# EasyEDA Pro project ADC.eprj

# Schematic Schematic1
Create Date: 2023-12-13; Page Name: P1; Project Name: ADC; Schematic Name: Schematic1; Update Date: 2023-12-21; Company: 嘉立创EDA; Page Size: A4; Version: V1.0
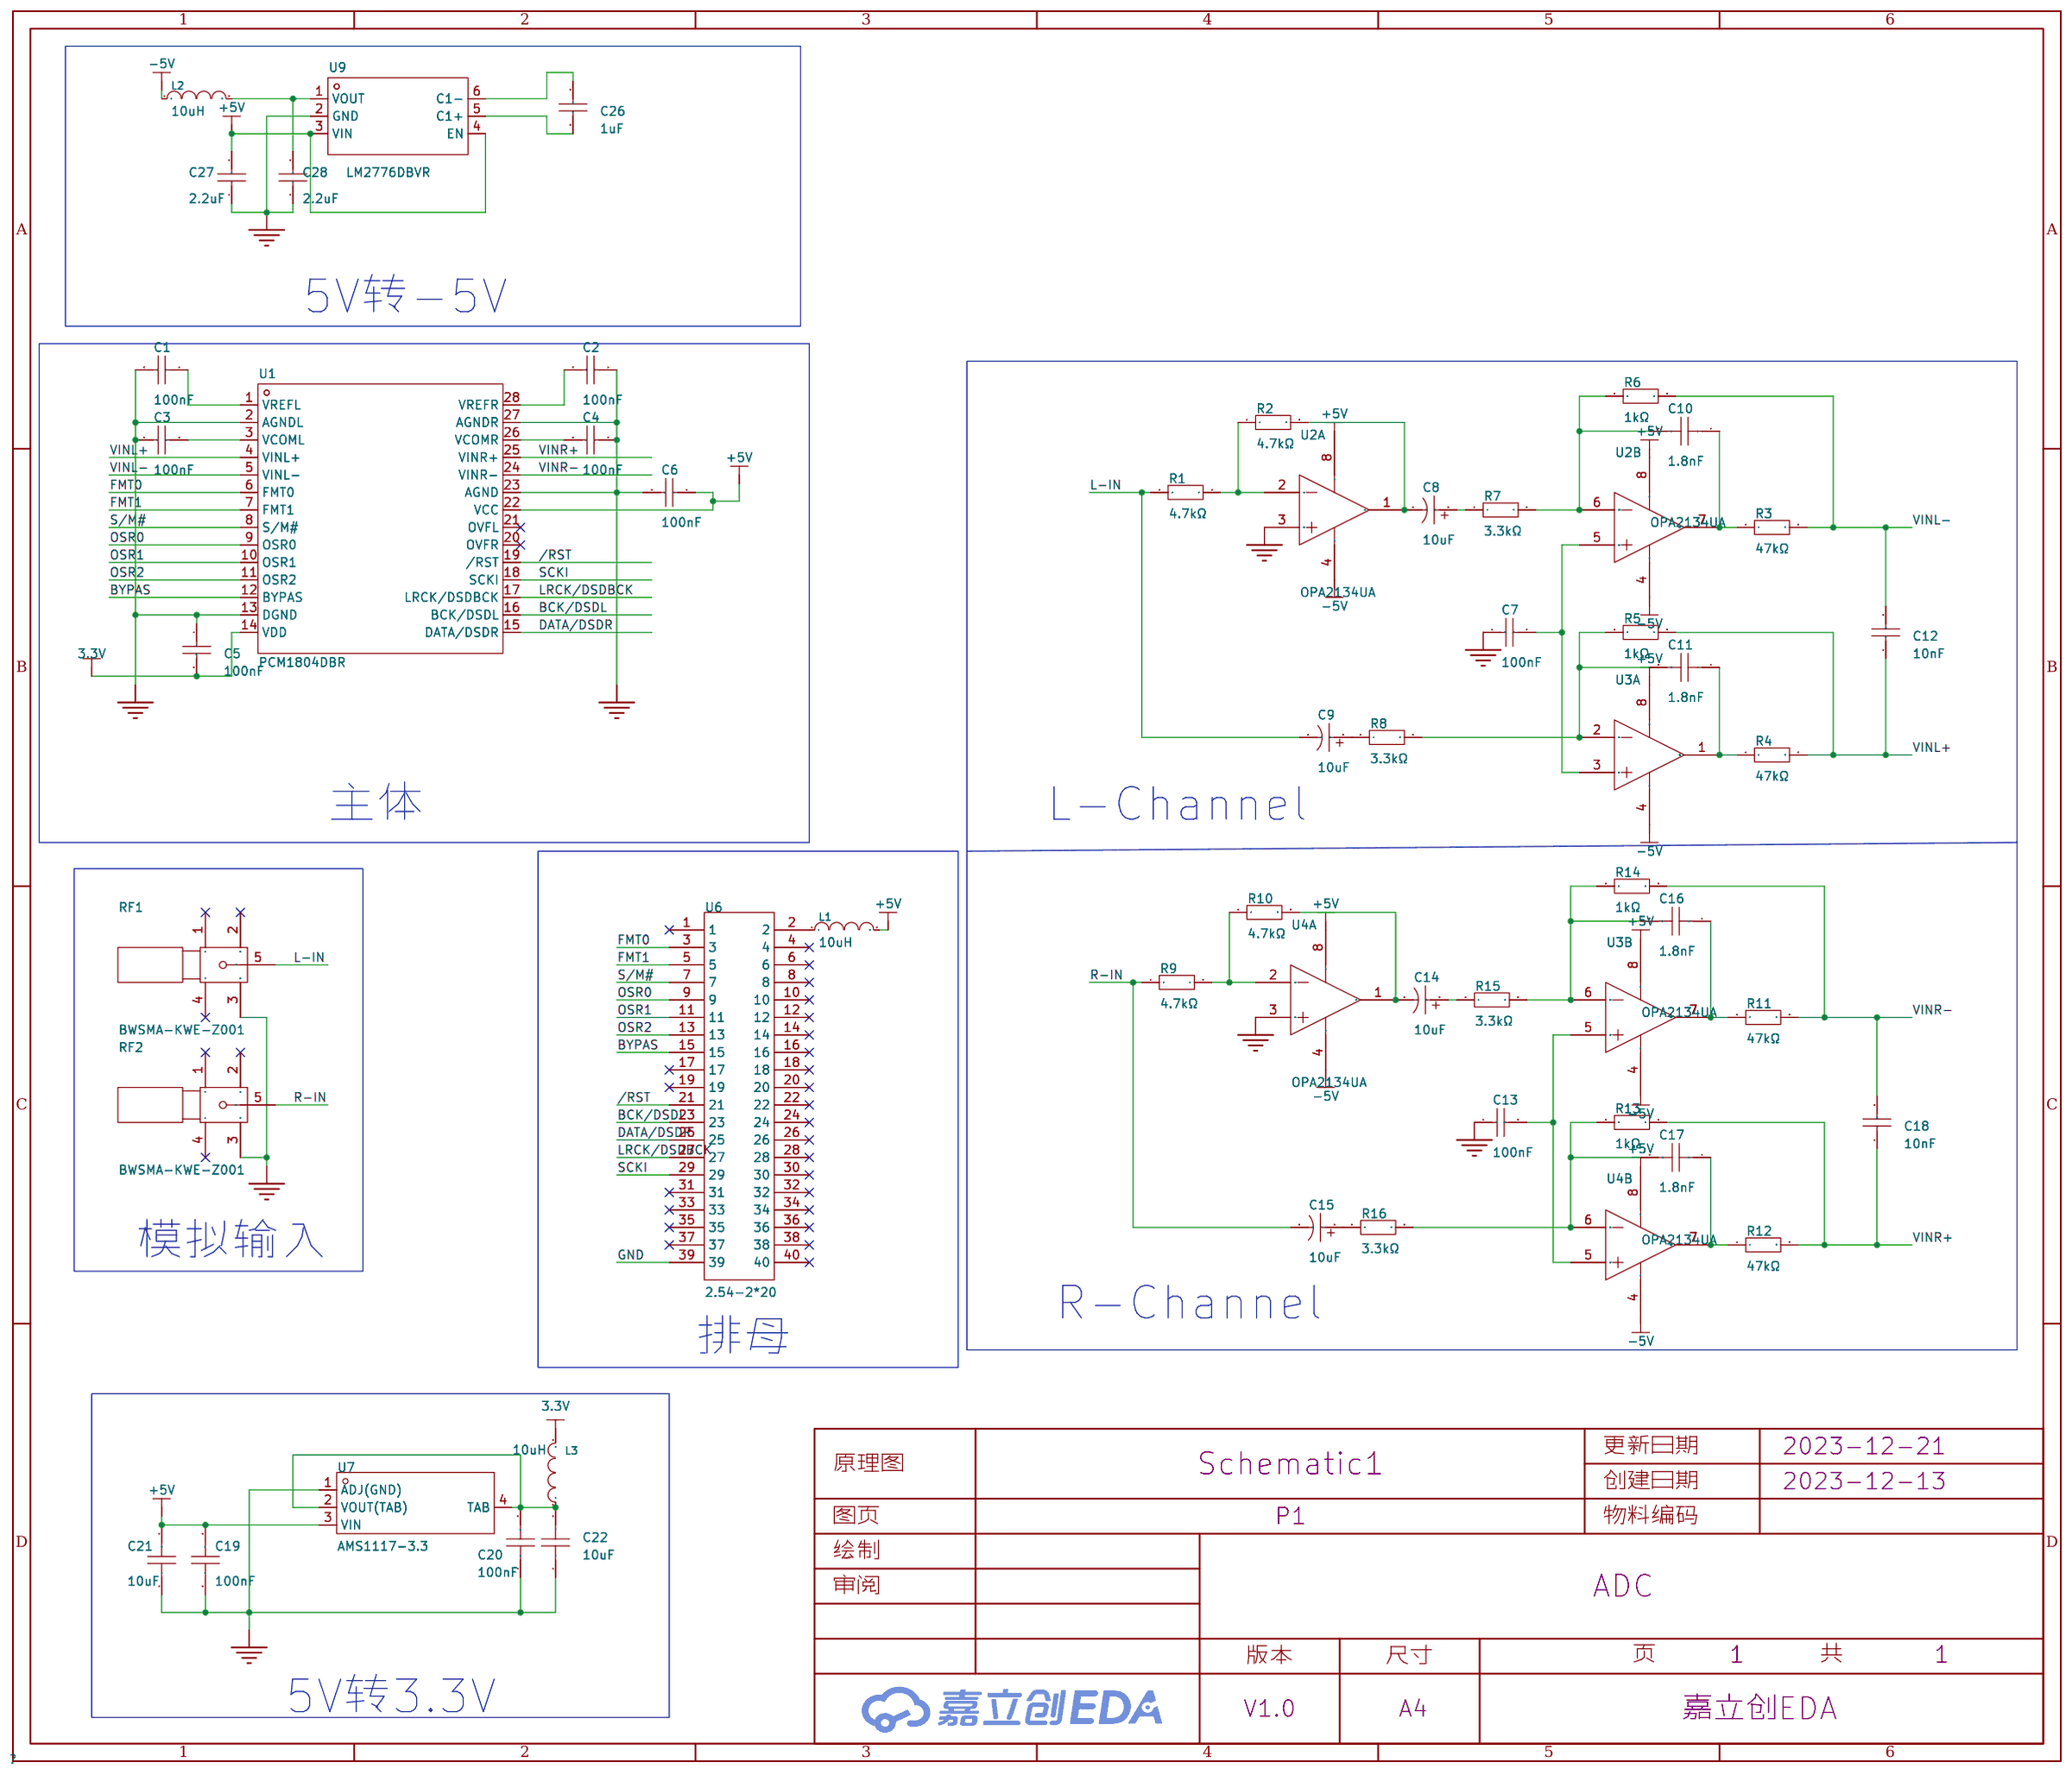
[diagram p0: schematic sheet]

## Parts
C1  100nF  [C0603]
C2  100nF  [C0603]
C3  100nF  [C0603]
C4  100nF  [C0603]
C5  100nF  [C0603]
C6  100nF  [C0603]
C7  100nF  [C0603]
C8  10uF  [CAP-SMD_BD6.3-L6.6-W6.6-FD]
C9  10uF  [CAP-SMD_BD6.3-L6.6-W6.6-FD]
C10  1.8nF  [C0603]
C11  1.8nF  [C0603]
C12  10nF  [C0603]
C13  100nF  [C0603]
C14  10uF  [CAP-SMD_BD6.3-L6.6-W6.6-FD]
C15  10uF  [CAP-SMD_BD6.3-L6.6-W6.6-FD]
C16  1.8nF  [C0603]
C17  1.8nF  [C0603]
C18  10nF  [C0603]
C19  100nF  [C0603]
C20  100nF  [C0603]
C21  10uF  [C0603]
C22  10uF  [C0603]
C26  1uF  [C0603]
C27  2.2uF  [C0603]
C28  2.2uF  [C0603]
L1  10uH  [L0603]
L2  10uH  [L0603]
L3  10uH  [L0603]
R1  4.7kΩ  [R0603]
R2  4.7kΩ  [R0603]
R3  47kΩ  [R0603]
R4  47kΩ  [R0603]
R5  1kΩ  [R0603]
R6  1kΩ  [R0603]
R7  3.3kΩ  [R0603]
R8  3.3kΩ  [R0603]
R9  4.7kΩ  [R0603]
R10  4.7kΩ  [R0603]
R11  47kΩ  [R0603]
R12  47kΩ  [R0603]
R13  1kΩ  [R0603]
R14  1kΩ  [R0603]
R15  3.3kΩ  [R0603]
R16  3.3kΩ  [R0603]
RF1  BWSMA-KWE-Z001  [SMA-TH_BWSMA-KWE-Z001]
RF2  BWSMA-KWE-Z001  [SMA-TH_BWSMA-KWE-Z001]
U1  PCM1804DBR  [SSOP-28_L10.2-W5.3-P0.65-LS7.8-BL]
U2  OPA2134UA  [SOIC-8_L4.9-W3.9-P1.27-LS6.0-BL]  (sections 1,2)
U3  OPA2134UA  [SOIC-8_L4.9-W3.9-P1.27-LS6.0-BL]  (sections 1,2)
U4  OPA2134UA  [SOIC-8_L4.9-W3.9-P1.27-LS6.0-BL]  (sections 1,2)
U6  2.54-2*20  [HDR-TH_40P-P2.54-V-F-R2-C20-S2.54]
U7  AMS1117-3.3  [SOT-223-4_L6.5-W3.5-P2.30-LS7.0-BR]
U9  LM2776DBVR  [SOT-23-6_L2.9-W1.6-P0.95-LS2.8-BR]

## Library data of the parts
C1-C7 C13 = CC0603KRX7R9BB104: 容值:100nF;精度:±10%;额定电压:50V;材质(温度系数):X7R;; LCSC Part Name: 100nF ±10% 50V; Supplier Part: C14663; Manufacturer: YAGEO(国巨); Supplier Footprint: 0603; JLCPCB Part Class: Basic Part; Datasheet: https://atta.szlcsc.com/upload/public/pdf/source/20180910/C282072_33301C7F631E79921B82A8DAC6BCC5B3.pdf; Supplier: LCSC; Tolerance: ±10%; Voltage Rated: 50V; Temperature Coefficient: X7R
C8 C9 C14 C15 = RVT2A100M0607_C72482: 容值:10uF;精度:±20%;额定电压:100V;纹波电流:38mA@120Hz;等效串联电阻:-;; LCSC Part Name: 10uF ±20% 100V; Supplier Part: C72482; Manufacturer: ROQANG(容强); Manufacturer Part: RVT2A100M0607; Supplier Footprint: SMD,D6.3xL7.7mm; JLCPCB Part Class: 扩展库; Datasheet: https://atta.szlcsc.com/upload/public/pdf/source/20170325/1490427950282.pdf; Supplier: LCSC; Tolerance: ±20%; Rated Voltage: 100V; Ripple Current: 38mA@120Hz; φD: 6.3mm; L: 7.7mm; Lifetime @ Temp: 2000hrs@105℃; Operating Temperature: -40℃~+105℃
C10 C11 C16 C17 = 0603B182K500NT: 容值:1.8nF;精度:±10%;额定电压:50V;材质(温度系数):X7R;; LCSC Part Name: 1.8nF ±10% 50V; Supplier Part: C1599; Manufacturer: FH(风华); Supplier Footprint: 0603; JLCPCB Part Class: Extended Part; Datasheet: https://atta.szlcsc.com/upload/public/pdf/source/20200305/C486355_26A10D38EF8C2A5C37091D0039909270.pdf; Supplier: LCSC; Tolerance: ±10%; Voltage Rated: 50V; Temperature Coefficient: X7R
C12 C18 = CC0603KRX7R9BB103: 容值:10nF;精度:±10%;额定电压:50V;材质(温度系数):X7R;; LCSC Part Name: 10nF ±10% 50V; Supplier Part: C100042; Manufacturer: YAGEO(国巨); Supplier Footprint: 0603; JLCPCB Part Class: Extended Part; Datasheet: https://atta.szlcsc.com/upload/public/pdf/source/20181008/C309510_22F155564471FAF6A489F7D68F34234E.pdf; Supplier: LCSC; Tolerance: ±10%; Voltage Rated: 50V; Temperature Coefficient: X7R
C19 C20 = CC0603KRX7R9BB104: 容值:100nF;精度:±10%;额定电压:50V;材质(温度系数):X7R;; LCSC Part Name: 100nF ±10% 50V; Supplier Part: C14663; Manufacturer: YAGEO(国巨); Supplier Footprint: 0603; JLCPCB Part Class: 基础库; Datasheet: https://atta.szlcsc.com/upload/public/pdf/source/20180910/C282072_33301C7F631E79921B82A8DAC6BCC5B3.pdf; Supplier: LCSC; Tolerance: ±10%; Voltage Rated: 50V; Temperature Coefficient: X7R
C21 C22 = CL10A106KP8NNNC: 容值:10uF;精度:±10%;额定电压:10V;材质(温度系数):X5R;; LCSC Part Name: 10uF ±10% 10V; Supplier Part: C19702; Manufacturer: SAMSUNG(三星); Supplier Footprint: 0603; JLCPCB Part Class: 基础库; Datasheet: https://atta.szlcsc.com/upload/public/pdf/source/20160218/1457707763339.pdf; Supplier: LCSC; Tolerance: ±10%; Voltage Rated: 10V; Temperature Coefficient: X5R
C26 = CL10A105KB8NNNC: 容值:1uF;精度:±10%;额定电压:50V;材质(温度系数):X5R;; LCSC Part Name: 1uF ±10% 50V; Supplier Part: C15849; Manufacturer: SAMSUNG(三星); Supplier Footprint: 0603; JLCPCB Part Class: 基础库; Datasheet: https://atta.szlcsc.com/upload/public/pdf/source/20160218/1457707763339.pdf; Supplier: LCSC; Tolerance: ±10%; Voltage Rated: 50V; Temperature Coefficient: X5R
C27 C28 = CL10A225KO8NNNC: 容值:2.2uF;精度:±10%;额定电压:16V;材质(温度系数):X5R;; LCSC Part Name: 2.2uF ±10% 16V; Supplier Part: C23630; Manufacturer: SAMSUNG(三星); Supplier Footprint: 0603; JLCPCB Part Class: 基础库; Datasheet: https://atta.szlcsc.com/upload/public/pdf/source/20160218/1457707763339.pdf; Supplier: LCSC; Tolerance: ±10%; Voltage Rated: 16V; Temperature Coefficient: X5R
L1-L3 = SDFL1608S100KTF: 电感值:10uH;精度:±10%;额定电流:3mA;饱和电流(Isat):-;直流电阻(DCR):1.85Ω;; LCSC Part Name: 10uH ±10% 3mA 1.85Ω; Supplier Part: C1035; Manufacturer: Sunlord(顺络); Supplier Footprint: 0603; JLCPCB Part Class: 基础库; Supplier: LCSC; Tolerance: ±10%; Rated Current: 3mA; DC Resistance (DCR): 1.85Ω; Q @ Freq: 30@2MHz; Frequency - Self Resonant: 2MHz
R1 R2 R9 R10 = 0603WAF4701T5E: 阻值:4.7kΩ;精度:±1%;功率:100mW;温度系数:±100ppm/℃;电阻类型:厚膜电阻;; LCSC Part Name: 4.7kΩ ±1% 100mW 厚膜电阻; Supplier Part: C23162; Manufacturer: UNI-ROYAL(厚声); Supplier Footprint: 0603; JLCPCB Part Class: 基础库; Datasheet: https://atta.szlcsc.com/upload/public/pdf/source/20200306/C422600_1E6D84923E4A46A82E41ADD87F860B5C.pdf; Supplier: LCSC; Tolerance: ±1%; Power(Watts): 100mW; Overload Voltage (Max): 75V; Temperature Coefficient: ±100ppm/℃; Type: 厚膜电阻; Operating Temperature Range: -55℃~+155℃
R3 R4 R11 R12 = 0603WAF4702T5E: 阻值:47kΩ;精度:±1%;功率:100mW;温度系数:±100ppm/℃;电阻类型:厚膜电阻;; LCSC Part Name: 47kΩ ±1% 100mW 厚膜电阻; Supplier Part: C25819; Manufacturer: UNI-ROYAL(厚声); Supplier Footprint: 0603; JLCPCB Part Class: 基础库; Datasheet: https://atta.szlcsc.com/upload/public/pdf/source/20200306/C422600_1E6D84923E4A46A82E41ADD87F860B5C.pdf; Supplier: LCSC; Tolerance: ±1%; Power(Watts): 100mW; Overload Voltage (Max): 75V; Temperature Coefficient: ±100ppm/℃; Type: 厚膜电阻; Operating Temperature Range: -55℃~+155℃
R5 R6 R13 R14 = 0603WAF1001T5E: 阻值:1kΩ;精度:±1%;功率:100mW;温度系数:±100ppm/℃;电阻类型:厚膜电阻;; LCSC Part Name: 1kΩ ±1% 100mW 厚膜电阻; Supplier Part: C21190; Manufacturer: UNI-ROYAL(厚声); Supplier Footprint: 0603; JLCPCB Part Class: Basic Part; Datasheet: https://atta.szlcsc.com/upload/public/pdf/source/20200306/C422600_1E6D84923E4A46A82E41ADD87F860B5C.pdf; Supplier: LCSC; Tolerance: ±1%; Power(Watts): 100mW; Overload Voltage (Max): 75V; Temperature Coefficient: ±100ppm/℃; Type: 厚膜电阻; Operating Temperature Range: -55℃~+155℃
R7 R8 R15 R16 = 0603WAF3301T5E: 阻值:3.3kΩ;精度:±1%;功率:100mW;温度系数:±100ppm/℃;电阻类型:厚膜电阻;; LCSC Part Name: 3.3kΩ ±1% 100mW 厚膜电阻; Supplier Part: C22978; Manufacturer: UNI-ROYAL(厚声); Supplier Footprint: 0603; JLCPCB Part Class: 基础库; Datasheet: https://atta.szlcsc.com/upload/public/pdf/source/20200306/C422600_1E6D84923E4A46A82E41ADD87F860B5C.pdf; Supplier: LCSC; Tolerance: ±1%; Power(Watts): 100mW; Overload Voltage (Max): 75V; Temperature Coefficient: ±100ppm/℃; Type: 厚膜电阻; Operating Temperature Range: -55℃~+155℃
RF1 RF2 = BWSMA-KWE-Z001: 连接器类型:板端;接口类型:内孔;频率-最大值:-;接口直径:5.3mm;射频系列:SMA;端口数量:1;阻抗:50Ω;样式:弯头;接口长度/高度:-;触头材质:-;触头镀层:-;工作温度范围:-;焊接温度(最大值):-;; LCSC Part Name: 内孔 SMA 弯头 SMA 天线座 SMA弯头正脚板端座子; Supplier Part: C496551; Manufacturer: BAT WIRELESS(蝙蝠无线); Supplier Footprint: 插件; JLCPCB Part Class: 扩展库; Datasheet: https://atta.szlcsc.com/upload/public/pdf/source/20231017/997A8C2ADA7F8034A89BE1264F38CE52.pdf; Supplier: LCSC; Connector Type: 板端; Interface Type: 内孔; Interface Diameter: 5.3mm; RF Series: SMA; Number of Ports: 1; Impedance: 50Ω; Style: 弯头
U1 = PCM1804DBR: 供电电压:3V~3.6V；4.75V~5.25V;分辨率(位):24;接口类型:I2S;; Supplier Part: C62360; Manufacturer: TI(德州仪器); Supplier Footprint: SSOP-28-208mil; JLCPCB Part Class: 扩展库; Datasheet: https://www.ti.com/cn/lit/gpn/pcm1804; Supplier: LCSC; Supply Voltage: 3V~3.6V；4.75V~5.25V; Number of Channels: 2; Resolution: 24; Interface Type: I2S; Operating Temperature: -10℃~+70℃
U2-U4 = OPA2134UA: 功放类型:-;扬声器通道数:2通道;输出功率:-;; Supplier Part: C2860321; Manufacturer: TI(德州仪器); Supplier Footprint: SOIC-8; JLCPCB Part Class: Extended Part; Datasheet: https://atta.szlcsc.com/upload/public/pdf/source/20230221/04F5AACAA47A202A62C17BFD20F1D2D5.pdf; Supplier: LCSC; Speaker Channels: 2通道; Operating Temperature: -40℃~+85℃
U6 = 2.54-2*20: 排数:双排;总孔位数:40P;间距:2.54mm;插孔结构:2x20P;行距:2.54mm;安装类型:直插;圆孔/方孔:方孔;额定电流:2.5A;额定电压:-;插孔方向:顶部;塑高:8.5mm;工作温度范围:-40℃~+105℃;; LCSC Part Name: 间距:2.54mm 2x20P 直插 镀金环保阻燃UL认证; Supplier Part: C2977589; Manufacturer: ZHOURI(洲日); Supplier Footprint: 插件,P=2.54mm; JLCPCB Part Class: 扩展库; Datasheet: https://atta.szlcsc.com/upload/public/pdf/source/20220328/834E302BE3C038BBC5C70F5E02589B1E.pdf; Supplier: LCSC; Number of Rows: 双排; Number of Holes: 40P; Pitch: 2.54mm; Holes Structure: 2x20P; Row Spacing: 2.54mm; Mounting Type: 直插; Circular Hole / Square Hole: 方孔; Current Rating (Max): 2.5A; Holes Direction: 顶部; Insulation Height: 8.5mm; Operating Temperature Range: -40℃~+105℃
U7 = AMS1117-3.3_C347222: 输出类型:固定;最大输入电压:18V;输出电压:3.3V;输出电流:1A;电源纹波抑制比(PSRR):60dB@(120Hz);输出极性:正;; LCSC Part Name: 输入18V 输出3.3V 1A; Supplier Part: C347222; Manufacturer: UMW(友台半导体); Supplier Footprint: SOT-223; JLCPCB Part Class: 扩展库; Datasheet: https://atta.szlcsc.com/upload/public/pdf/source/20231109/155D79A26D9DB04352555A58D5969DC8.pdf; Supplier: LCSC; Output Type: 固定; Maximum Input Voltage: 18V; Output Voltage: 3.3V; Output Current: 1A; Power Supply Rejection Ratio (PSRR): 60dB@(120Hz); Dropout Voltage: 1.3V@(1A); Output Polarity: 正; Number of Outputs: 1
U9 = LM2776DBVR: 功能类型:电荷泵;输出类型:固定;输入电压:2.7V~5.5V;输出电压:-5.5V~-2.7V;输出电流(最大值):200mA;; Supplier Part: C69527; Manufacturer: TI(德州仪器); Supplier Footprint: SOT-23-6; JLCPCB Part Class: 扩展库; Datasheet: https://www.ti.com/cn/lit/gpn/lm2776; Supplier: LCSC; Function: 电荷泵; Synchronous Rectification: 否; Output Type: 固定; Number of Outputs: 1; Input Voltage: 2.7V~5.5V; Output Voltage: -5.5V~-2.7V; Output Current (Max): 200mA; Switching Frequency: 2MHz; Operating Temperature: -40℃~+85℃@(TA)

## Nets
3.3V: C5.2 L3.2 U1.14(VDD)
+5V: C6.1 C19.2 C21.2 C27.2 L1.2 U1.22(VCC) U2.8(V+) U3.8(V+) U4.8(V+) U7.3(VIN) U9.3(VIN) U9.4(EN)
-5V: L2.1 U2.4(V-) U3.4(V-) U4.4(V-)
GND: C1.2 C2.1 C3.2 C4.1 C5.1 C6.2 C7.1 C13.1 C19.1 C20.1 C21.1 C22.1 C27.1 C28.1 RF1.3 RF2.3 U1.2(AGNDL) U1.13(DGND) U1.23(AGND) U1.27(AGNDR) U2.3(+IN A) U4.3(+IN A) U6.39 U7.1(ADJ(GND)) U9.2(GND)
VINL+: C12.1 R4.2 R5.2 U1.4(VINL+)
VINL-: C12.2 R3.2 R6.2 U1.5(VINL-)
VINR+: C18.1 R12.2 R13.2 U1.25(VINR+)
VINR-: C18.2 R11.2 R14.2 U1.24(VINR-)
/RST: U1.19(/RST) U6.21
BCK/DSDL: U1.16(BCK/DSDL) U6.23
BYPAS: U1.12(BYPAS) U6.15
DATA/DSDR: U1.15(DATA/DSDR) U6.25
FMT0: U1.6(FMT0) U6.3
FMT1: U1.7(FMT1) U6.5
L-IN: C9.2 R1.1 RF1.5
LRCK/DSDBCK: U1.17(LRCK/DSDBCK) U6.27
OSR0: U1.9(OSR0) U6.9
OSR1: U1.10(OSR1) U6.11
OSR2: U1.11(OSR2) U6.13
R-IN: C15.2 R9.1 RF2.5
S/M#: U1.8(S/M#) U6.7
SCKI: U1.18(SCKI) U6.29
$1N1209: C1.1 U1.1(VREFL)
$1N1212: C3.1 U1.3(VCOML)
$1N1256: C2.2 U1.28(VREFR)
$1N1259: C4.2 U1.26(VCOMR)
$1N1970: R1.2 R2.1 U2.2(-IN A)
$1N1981: C8.2 R2.2 U2.1(OUT A)
$1N2182: C7.2 U2.5(+IN B) U3.3(+IN A)
$1N3561: C8.1 R7.1
$1N3720: C9.1 R8.1
$1N3842: C10.2 R6.1 R7.2 U2.6(-IN B)
$1N3853: C10.1 R3.1 U2.7(OUT B)
$1N3857: C11.1 R4.1 U3.1(OUT A)
$1N3861: C11.2 R5.1 R8.2 U3.2(-IN A)
$1N4676: R9.2 R10.1 U4.2(-IN A)
$1N4677: C14.2 R10.2 U4.1(OUT A)
$1N4679: C13.2 U3.5(+IN B) U4.5(+IN B)
$1N4681: C14.1 R15.1
$1N4683: C15.1 R16.1
$1N4688: C16.2 R14.1 R15.2 U3.6(-IN B)
$1N4694: C16.1 R11.1 U3.7(OUT B)
$1N4697: C17.1 R12.1 U4.7(OUT B)
$1N4700: C17.2 R13.1 R16.2 U4.6(-IN B)
$1N6196: C20.2 C22.2 L3.1 U7.2(VOUT(TAB)) U7.4(TAB)
$1N15402: L1.1 U6.2
$1N31086: C26.2 U9.6(C1-)
$1N31091: C26.1 U9.5(C1+)
$1N34155: C28.2 L2.2 U9.1(VOUT)

Not connected (* = marked no-connect by the designer): RF1 1* 2* 4*; RF2 1* 2* 4*; U1 20(OVFR)* 21(OVFL)*; U6 1* 4* 6* 8* 10* 12* 14* 16* 17* 18* 19* 20* 22* 24* 26* 28* 30* 31* 32* 33* 34* 35* 36* 37* 38* 40*

## Notes on the sheet
- 5V转-5V
- 主体
- L-Channel
- 模拟输入
- R-Channel
- 排母
- 5V转3.3V

# Board PCB1
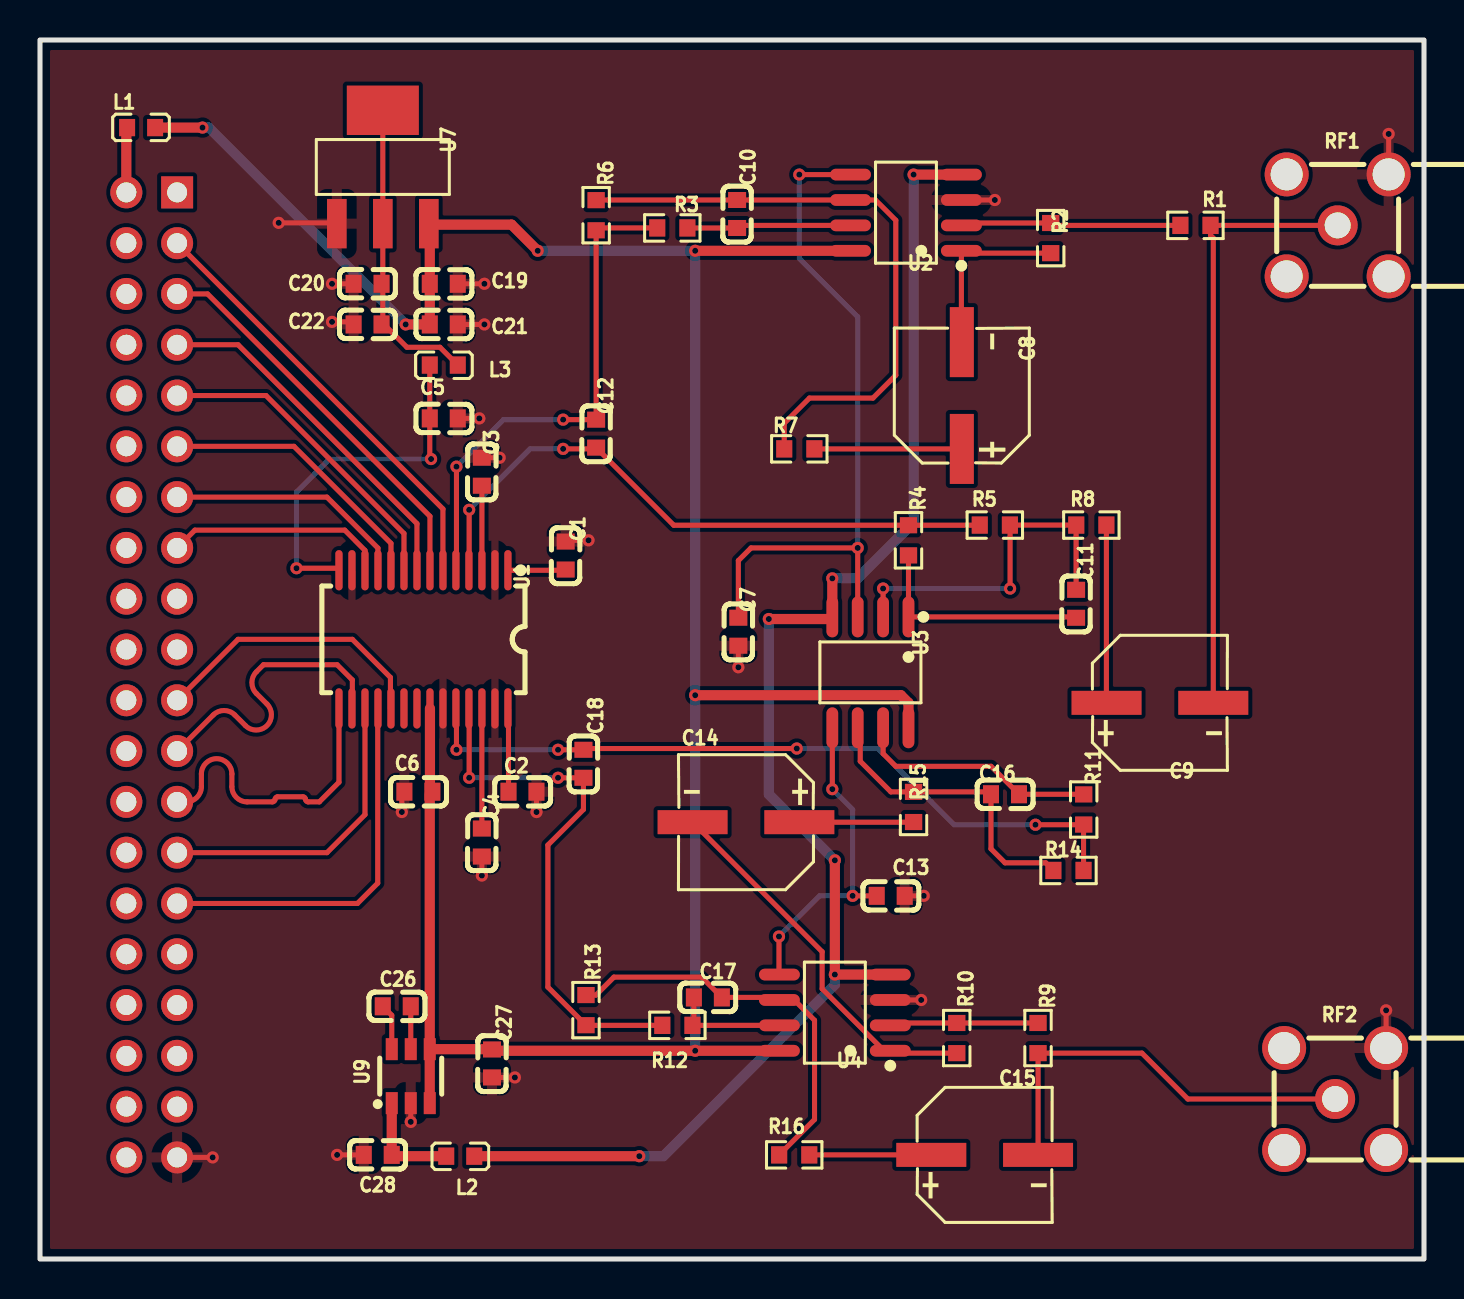
[diagram p1: board, top side]
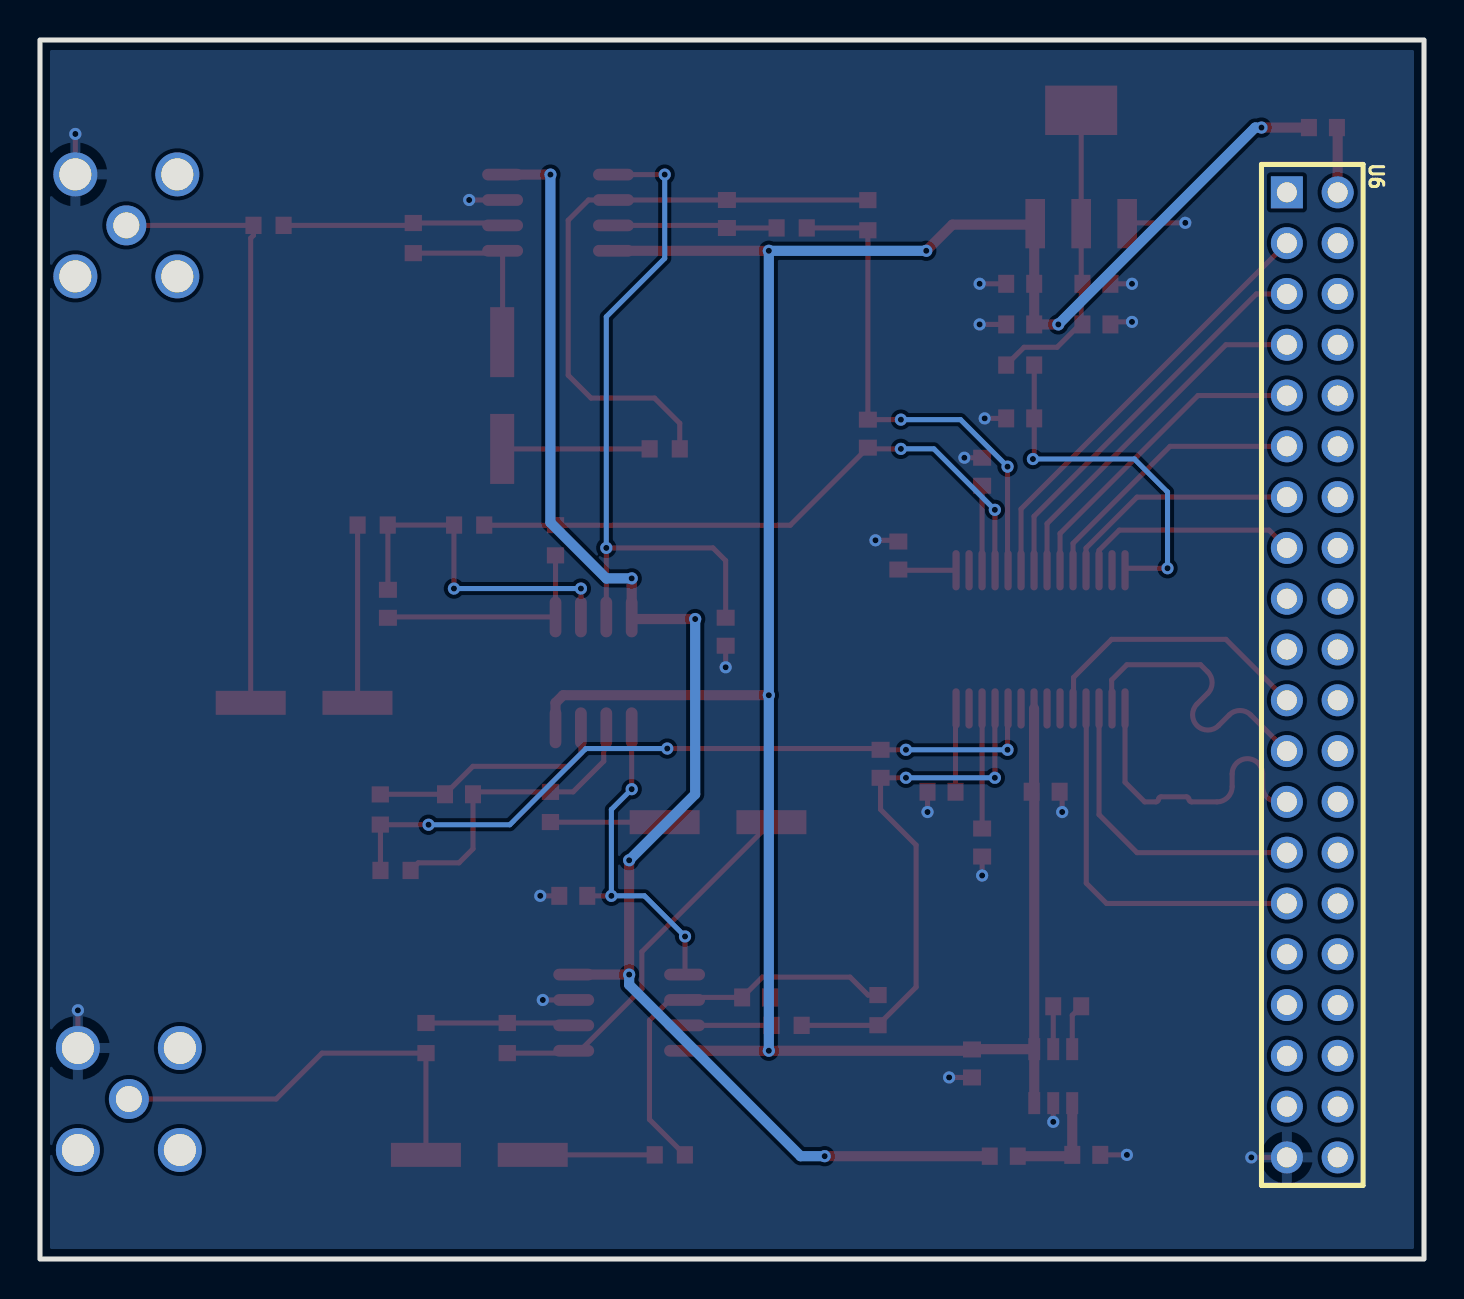
[diagram p2: board, bottom side, seen from below]

Outline 69.22 x 60.96 mm; copper layers: Top Layer, Bottom Layer. Coordinates in mm from the lower left corner of the outline.
Outline path: rectangle 0,60.96 69.22,0
Stack: Top Layer 0.035mm - / Dielectric1 1.51mm FR4 er 4.5 / Bottom Layer 0.035mm -

## Design rules (mm)
template: 自定义配置
spacing copperThickness1oz (default): track to track 0.102, other pairs 0.152 to 0.3
spacing copperThickness2oz: track to track 0.203, other pairs 0.152 to 0.3
track width copperThickness1oz (default): min 0.127, default 0.254, max 2.54
track width copperThickness2oz: min 0.203, default 0.254, max 2.54
differential pair differentialPair (default): width min 0.127, default 0.254, max 2.54; gap min 0.152, default 0.152
via viaSize (default): diameter min 0.5, default 0.61, max 10; hole min 0.3, default 0.305, max 6.299

## Placement (name value [footprint] x y rotation side)
C1  100nF  [C0603]  26.29 35.18 90 top
C2  100nF  [C0603]  24.13 23.37 180 top
C3  100nF  [C0603]  22.1 39.37 90 top
C4  100nF  [C0603]  22.1 20.83 90 top
C5  100nF  [C0603]  20.19 42.04 180 top
C6  100nF  [C0603]  18.92 23.37 180 top
C7  100nF  [C0603]  34.93 31.37 90 top
C8  10uF  [CAP-SMD_BD6.3-L6.6-W6.6-FD]  46.1 43.18 90 top
C9  10uF  [CAP-SMD_BD6.3-L6.6-W6.6-FD]  56.01 27.81 0 top
C10  1.8nF  [C0603]  34.86 52.26 90 top
C11  1.8nF  [C0603]  51.82 32.77 90 top
C12  10nF  [C0603]  27.81 41.28 90 top
C13  100nF  [C0603]  42.54 18.16 180 top
C14  10uF  [CAP-SMD_BD6.3-L6.6-W6.6-FD]  35.31 21.84 180 top
C15  10uF  [CAP-SMD_BD6.3-L6.6-W6.6-FD]  47.24 5.21 0 top
C16  1.8nF  [C0603]  48.26 23.24 180 top
C17  1.8nF  [C0603]  33.4 13.08 0 top
C18  10nF  [C0603]  27.18 24.77 90 top
C19  100nF  [C0603]  20.19 48.77 180 top
C20  100nF  [C0603]  16.38 48.77 0 top
C21  10uF  [C0603]  20.19 46.74 180 top
C22  10uF  [C0603]  16.38 46.74 0 top
C26  1uF  [C0603]  17.84 12.64 180 top
C27  2.2uF  [C0603]  22.61 9.78 90 top
C28  2.2uF  [C0603]  16.89 5.21 0 top
L1  10uH  [L0603]  5.06 56.58 0 top
L2  10uH  [L0603]  21.02 5.14 180 top
L3  10uH  [L0603]  20.19 44.7 180 top
R1  4.7kΩ  [R0603]  57.78 51.69 180 top
R2  4.7kΩ  [R0603]  50.55 51.05 270 top
R3  47kΩ  [R0603]  31.62 51.56 180 top
R4  47kΩ  [R0603]  43.43 35.94 90 top
R5  1kΩ  [R0603]  47.75 36.7 180 top
R6  1kΩ  [R0603]  27.81 52.2 270 top
R7  3.3kΩ  [R0603]  37.97 40.51 180 top
R8  3.3kΩ  [R0603]  52.58 36.7 180 top
R9  4.7kΩ  [R0603]  49.91 11.05 90 top
R10  4.7kΩ  [R0603]  45.85 11.05 270 top
R11  47kΩ  [R0603]  52.2 22.48 270 top
R12  47kΩ  [R0603]  31.88 11.68 180 top
R13  1kΩ  [R0603]  27.31 12.45 270 top
R14  1kΩ  [R0603]  51.44 19.43 0 top
R15  3.3kΩ  [R0603]  43.69 22.61 90 top
R16  3.3kΩ  [R0603]  37.72 5.21 180 top
RF1  BWSMA-KWE-Z001  [SMA-TH_BWSMA-KWE-Z001]  64.9 51.69 0 top
RF2  BWSMA-KWE-Z001  [SMA-TH_BWSMA-KWE-Z001]  64.77 8 0 top
U1  PCM1804DBR  [SSOP-28_L10.2-W5.3-P0.65-LS7.8-BL]  19.18 30.99 180 top
U2  OPA2134UA  [SOIC-8_L4.9-W3.9-P1.27-LS6.0-BL]  43.31 52.32 90 top
U3  OPA2134UA  [SOIC-8_L4.9-W3.9-P1.27-LS6.0-BL]  41.53 29.34 180 top
U4  OPA2134UA  [SOIC-8_L4.9-W3.9-P1.27-LS6.0-BL]  39.75 12.32 90 top
U6  2.54-2*20  [HDR-TH_40P-P2.54-V-F-R2-C20-S2.54]  5.59 29.21 270 bottom
U7  AMS1117-3.3  [SOT-223-4_L6.5-W3.5-P2.30-LS7.0-BR]  17.15 54.61 270 top
U9  LM2776DBVR  [SOT-23-6_L2.9-W1.6-P0.95-LS2.8-BR]  18.54 9.14 270 top

## Footprints (pads in the part's own frame, mm; a bottom-side part is the same pattern mirrored in y, then rotated)
C0603
  rect 0.8x0.9 smd: 1(-0.7,0) 2(0.7,0)
CAP-SMD_BD6.3-L6.6-W6.6-FD
  rect 3.5x1.2 smd: 1(-2.67,0) 2(2.67,0)
HDR-TH_40P-P2.54-V-F-R2-C20-S2.54
  rect 1.6x1.6 hole 1: 1(-24.13,-1.27)
  round 1.6 hole 1: 2(-24.13,1.27) 3(-21.59,-1.27) 4(-21.59,1.27) 5(-19.05,-1.27) 6(-19.05,1.27) 7(-16.51,-1.27) 8(-16.51,1.27) 9(-13.97,-1.27) 10(-13.97,1.27) 11(-11.43,-1.27) 12(-11.43,1.27) 13(-8.89,-1.27) 14(-8.89,1.27) 15(-6.35,-1.27) 16(-6.35,1.27) 17(-3.81,-1.27) 18(-3.81,1.27) 19(-1.27,-1.27) 20(-1.27,1.27) 21(1.27,-1.27) 22(1.27,1.27) 23(3.81,-1.27) 24(3.81,1.27) 25(6.35,-1.27) 26(6.35,1.27) 27(8.89,-1.27) 28(8.89,1.27) 29(11.43,-1.27) 30(11.43,1.27) 31(13.97,-1.27) 32(13.97,1.27) 33(16.51,-1.27) 34(16.51,1.27) 35(19.05,-1.27) 36(19.05,1.27) 37(21.59,-1.27) 38(21.59,1.27) 39(24.13,-1.27) 40(24.13,1.27)
L0603
  rect 0.8x0.864 smd: 1(-0.7,0) 2(0.7,0)
R0603
  rect 0.806x0.864 smd: 1(-0.753,0) 2(0.753,0)
SMA-TH_BWSMA-KWE-Z001
  round 2.2 hole 1.6: 1(-2.55,-2.55) 2(-2.55,2.55) 3(2.55,2.55) 4(2.55,-2.55)
  round 2 hole 1.3: 5(0,0)
SOIC-8_L4.9-W3.9-P1.27-LS6.0-BL
  oval 0.588x2.045 smd: 1(-1.905,-2.772) 2(-0.635,-2.772) 3(0.635,-2.772) 4(1.905,-2.772) 5(1.905,2.772) 6(0.635,2.772) 7(-0.635,2.772) 8(-1.905,2.772)
SOT-23-6_L2.9-W1.6-P0.95-LS2.8-BR
  rect 1.1x0.6 smd: 1(1.35,-0.95) 2(1.35,0) 3(1.35,0.95) 4(-1.35,0.95) 5(-1.35,0) 6(-1.35,-0.95)
SOT-223-4_L6.5-W3.5-P2.30-LS7.0-BR
  rect 2.47x0.98 smd: 1(2.835,-2.3) 2(2.835,0) 3(2.835,2.3)
  rect 2.47x3.6 smd: 4(-2.835,0)
SSOP-28_L10.2-W5.3-P0.65-LS7.8-BL
  oval 0.364x2.015 smd: 1(-4.225,-3.455) 2(-3.575,-3.455) 3(-2.925,-3.455) 4(-2.275,-3.455) 5(-1.625,-3.455) 6(-0.975,-3.455) 7(-0.325,-3.455) 8(0.325,-3.455) 9(0.975,-3.455) 10(1.625,-3.455) 11(2.275,-3.455) 12(2.925,-3.455) 13(3.575,-3.455) 14(4.225,-3.455) 15(4.225,3.455) 16(3.575,3.455) 17(2.925,3.455) 18(2.275,3.455) 19(1.625,3.455) 20(0.975,3.455) 21(0.325,3.455) 22(-0.325,3.455) 23(-0.975,3.455) 24(-1.625,3.455) 25(-2.275,3.455) 26(-2.925,3.455) 27(-3.575,3.455) 28(-4.225,3.455)

## Nets
As in the schematic.

Pads without a net: RF1 1 2 4; RF2 1 2 4; U1 20 21; U6 1 4 6 8 10 12 14 16 17 18 19 20 22 24 26 28 30 31 32 33 34 35 36 37 38 40

## Via types
v1: diameter 0.61, hole 0.305, Top Layer to Bottom Layer, 52 vias

## Routing (per net, layer and track width the routed paths; a pad name or vN(x,y) marks a point on that pad's centre or on a via; arc(x,y) is an arc through that point)
3.3V: length 18.1
  Top Layer w0.254: v1(12.83,34.54) 14.85,34.54 U1.14 ; v1(19.56,40.01) 19.49,40.07 C5.2 L3.2
  Bottom Layer w0.254: v1(12.83,34.54) 12.83,38.35 14.48,40.01 v1(19.56,40.01)
+5V: length 133.5
  Top Layer w0.254: 19.49,51.73 19.44,51.78
  Top Layer w0.508: v1(24.89,50.42) 23.58,51.73 19.49,51.73 C19.2 C21.2 v1(18.29,46.74) ; 19.5,23.49 19.5,27.53 ; U4.8 v1(32.77,10.41) 22.67,10.41 C27.2 22.59,10.49 U9.4 ; U3.8 43.43,27.81 43.05,28.19 v1(32.77,28.19) ; 19.49,23.24 U9.4 ; U9.4 U9.3 ; v1(32.77,50.42) U2.8 ; 5.76,56.58 v1(8.13,56.58)
  Bottom Layer w0.508: v1(24.89,50.42) v1(32.77,50.42) v1(32.77,28.19) v1(32.77,10.41) ; v1(18.29,46.74) 8.44,56.58 v1(8.13,56.58)
-5V: length 74.2
  Top Layer w0.508: v1(39.62,34.04) U3.4 39.52,32 v1(36.45,32) ; L2.1 v1(29.97,5.14) ; v1(43.69,54.23) U2.4 ; v1(39.75,19.94) v1(39.75,14.22) U4.4
  Bottom Layer w0.508: v1(36.45,32) 36.45,23.24 v1(39.75,19.94) ; v1(43.69,54.23) 43.69,36.83 40.89,34.04 v1(39.62,34.04) ; v1(29.97,5.14) 31.18,5.14 39.75,13.72 v1(39.75,14.22)
GND: length 28.3
  Top Layer w0.254: C20.1 v1(14.6,48.77) ; 24.83,23.37 v1(24.83,22.35) ; C7.1 v1(34.93,29.59) ; 67.31,12.45 v1(67.32,12.44) 67.32,10.55 ; RF1.3 v1(67.45,56.26) ; v1(14.86,5.21) C28.1 ; C3.2 v1(22.99,40.07) ; U9.2 v1(18.54,6.86) ; C21.1 v1(22.22,46.74) ; C4.1 v1(22.1,19.18) ; C22.1 15.56,46.86 v1(14.6,46.86) ; C27.1 v1(23.75,9.08) ; C13.1 v1(44.2,18.16) ; C1.2 26.35,35.94 v1(27.43,35.94) ; 14.84,51.78 14.8,51.82 v1(11.94,51.82) ; 6.86,5.08 v1(8.64,5.08) ; U2.3 v1(47.75,52.96) ; U4.3 v1(44.07,12.95) ; C19.1 v1(22.22,48.77) ; C5.1 v1(21.97,42.04) ; 18.1,23.37 v1(18.1,22.35)
VINL+: length 31.5
  Top Layer w0.254: v1(26.16,40.51) 27.75,40.51 C12.1 31.69,36.69 R4.2 46.99,36.69 R5.2 ; U1.4 21.46,34.45 v1(21.46,37.47)
  Bottom Layer w0.254: v1(21.46,37.47) 24.51,40.51 v1(26.16,40.51)
VINL-: length 25.7
  Top Layer w0.254: R3.2 27.93,51.56 R6.2 C12.2 v1(26.16,41.98) ; v1(20.83,39.62) 20.83,34.47 U1.5
  Bottom Layer w0.254: v1(26.16,41.98) 23.18,41.98 v1(20.83,39.62)
VINR+: length 26.9
  Top Layer w0.254: R12.2 27.31,11.68 R13.2 25.4,13.6 25.4,20.7 27.18,22.48 C18.1 v1(25.91,24.07) ; U1.25 21.46,27.52 v1(21.46,24.07)
  Bottom Layer w0.254: v1(21.46,24.07) v1(25.91,24.07)
VINR-: length 37.3
  Top Layer w0.254: R14.2 52.19,21.72 ; 52.19,21.72 R11.2 ; 52.19,21.72 v1(49.78,21.72) ; U1.24 20.83,27.51 v1(20.83,25.47) ; v1(25.91,25.47) C18.2 27.24,25.53 v1(37.85,25.53)
  Bottom Layer w0.254: v1(37.85,25.53) 41.91,25.53 45.72,21.72 v1(49.78,21.72) ; v1(25.91,25.47) v1(20.83,25.47)
/RST: length 14.3
  Top Layer w0.254: 6.86,27.94 9.91,30.99 15.62,30.99 17.53,29.08 17.53,27.56 U1.19
BCK/DSDL: length 15.5
  Top Layer w0.254: U1.16 15.62,27.55 15.62,28.96 14.86,29.72 11.18,29.72 10.82,29.36 arc(10.6,28.82) 10.82,28.28 11.35,27.75 arc(11.35,26.68) 10.27,26.68 9.74,27.21 arc(9.2,27.43) 8.66,27.21 6.86,25.4
BYPAS: length 11.2
  Top Layer w0.254: U1.12 16.25,35.44 15.24,36.45 7.75,36.45 6.86,35.56
DATA/DSDR: length 15.5
  Top Layer w0.254: U1.15 14.95,23.84 13.97,22.86 13.41,22.86 arc(13.32,22.9) 13.28,22.99 arc(13.24,23.08) 13.15,23.11 11.88,23.11 arc(11.79,23.08) 11.75,22.99 arc(11.72,22.9) 11.63,22.86 10.36,22.86 arc(9.82,23.08) 9.6,23.62 9.6,24.26 arc(8.83,25.02) 8.07,24.26 8.07,23.62 arc(7.85,23.08) 7.31,22.86 6.86,22.86
FMT0: length 21.9
  Top Layer w0.254: U1.6 20.15,37.51 6.86,50.8
FMT1: length 19.9
  Top Layer w0.254: 6.86,48.26 8.38,48.26 19.5,37.14 19.5,34.44
L-IN: length 30.3
  Top Layer w0.254: C9.2 58.68,51.05 58.54,51.19 R1.1 RF1.5
LRCK/DSDBCK: length 15.5
  Top Layer w0.254: U1.17 16.25,22.22 14.35,20.32 6.86,20.32
OSR0: length 16
  Top Layer w0.254: 6.86,43.18 11.3,43.18 18.2,36.28 U1.9
OSR1: length 14
  Top Layer w0.254: 6.86,40.64 12.7,40.64 17.55,35.79 U1.10
OSR2: length 12.2
  Top Layer w0.254: U1.11 16.9,35.55 14.35,38.1 6.86,38.1
R-IN: length 20.9
  Top Layer w0.254: C15.2 49.91,10.29 R9.1 55.11,10.3 57.4,8 RF2.5
S/M#: length 18
  Top Layer w0.254: U1.8 18.85,36.77 9.91,45.72 6.86,45.72
SCKI: length 19.2
  Top Layer w0.254: 6.86,17.78 15.88,17.78 16.89,18.8 16.89,27.52 U1.18
$1N1209: length 2.9
  Top Layer w0.254: C1.1 26.25,34.44 U1.1
$1N1212: length 4.2
  Top Layer w0.254: C3.1 22.1,38.67 U1.3
$1N1256: length 4.2
  Top Layer w0.254: U1.28 23.43,27.51 C2.2
$1N1259: length 6
  Top Layer w0.254: C4.2 22.1,27.53 U1.26
$1N1970: length 11.1
  Top Layer w0.254: R1.2 50.66,51.69 R2.1 46.2,51.81 U2.2
$1N1981: length 9.1
  Top Layer w0.254: C8.2 46.08,45.87 U2.1 46.2,50.3 R2.2
$1N2182: length 35
  Top Layer w0.254: U3.3 v1(40.89,35.56) 35.56,35.56 34.93,34.93 C7.2 ; v1(37.97,54.23) U2.5
  Bottom Layer w0.254: v1(40.89,35.56) 40.89,47.12 37.97,50.04 v1(37.97,54.23)
$1N3561: length 7.4
  Top Layer w0.254: R7.1 38.73,40.51 C8.1
$1N3720: length 8.9
  Top Layer w0.254: R8.1 53.33,27.82 C9.1
$1N3842: length 31
  Top Layer w0.254: R6.1 27.82,52.96 C10.2 U2.6 41.78,52.96 42.8,51.94 42.8,44.2 41.66,43.05 38.48,43.05 37.22,41.79 R7.2
$1N3853: length 8.2
  Top Layer w0.254: R3.1 32.38,51.56 C10.1 34.99,51.69 U2.7
$1N3857: length 11.5
  Top Layer w0.254: C11.1 51.77,32.11 U3.1 R4.1
$1N3861: length 17.5
  Top Layer w0.254: C11.2 51.82,36.69 R8.2 R5.1 48.51,36.69 v1(48.51,33.53) ; v1(42.16,33.53) U3.2
  Bottom Layer w0.254: v1(42.16,33.53) v1(48.51,33.53)
$1N4676: length 7.4
  Top Layer w0.254: U4.2 42.64,11.8 R10.1 R9.2
$1N4677: length 19.1
  Top Layer w0.254: R10.2 42.64,10.3 U4.1 42.21,10.41 39.12,13.51 39.12,15.36 32.64,21.84
$1N4679: length 16.5
  Top Layer w0.254: v1(39.62,23.5) U3.5 ; C13.2 v1(40.64,18.16) ; U4.5 36.96,14.25 v1(36.96,16.13)
  Bottom Layer w0.254: v1(39.62,23.5) 40.64,22.48 v1(40.64,18.16) 38.99,18.16 v1(36.96,16.13)
$1N4681: length 5.7
  Top Layer w0.254: C14.1 43.68,21.84 R15.1
$1N4683: length 6.1
  Top Layer w0.254: C15.1 R16.1
$1N4688: length 15.2
  Top Layer w0.254: R14.1 50.3,19.81 48.26,19.81 47.56,20.51 C16.2 47.44,23.36 R15.2 42.55,23.36 41.02,24.89 41.02,26.44 U3.6
$1N4694: length 12.2
  Top Layer w0.254: R11.1 52.19,23.24 C16.1 47.56,24.64 42.8,24.64 42.16,25.27 U3.7
$1N4697: length 5.8
  Top Layer w0.254: C17.1 32.7,11.75 R12.1 U4.7
$1N4700: length 20.2
  Top Layer w0.254: R16.2 38.74,6.98 38.74,11.94 37.72,12.95 U4.6 36.85,13.08 C17.2 33.09,14.1 28.7,14.1 27.8,13.2 R13.1
$1N6196: length 15.4
  Top Layer w0.254: U7.4 17.15,48.83 ; 17.15,46.8 18.35,45.59 20,45.59 L3.1 ; 17.15,46.8 17.15,48.83 ; 17.15,46.8 C22.2 ; 17.15,48.83 C20.2
$1N15402: length 3.3
  Top Layer w0.508: L1.1 4.32,56.54 U6.2
$1N31086: length 2.3
  Top Layer w0.254: C26.2 17.59,12.19 U9.6
$1N31091: length 2.1
  Top Layer w0.254: U9.5 C26.1
$1N34155: length 5.3
  Top Layer w0.508: L2.2 17.66,5.14 C28.2 U9.1

## Copper pours and planes (outline as drawn; the poured copper is in the pictures)
GND on Top Layer: 0,60.96 69.22,60.96 69.22,0 0,0
GND on Bottom Layer: 0,61.12 69.22,61.12 69.22,0 0,0
